# Altium project usb-cereal-cp.PrjPCB
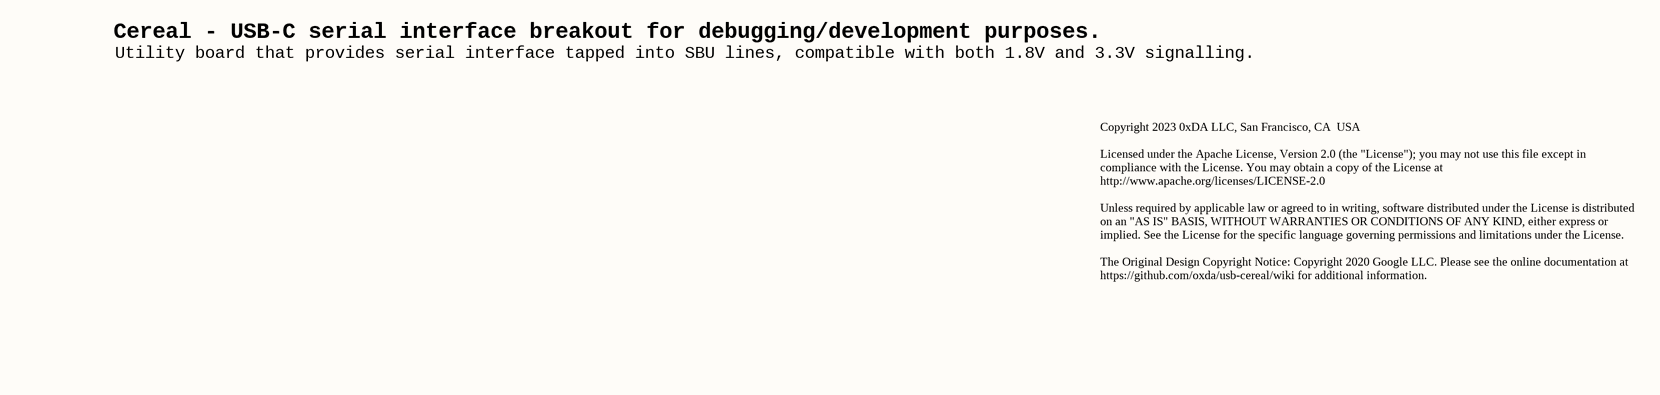
[diagram p0: usb-cereal-cp-sys.SchDoc]
2 sheets, 40 parts. Net scope: global (net labels, ports and power ports of the same name join across sheets).
Board file: usb-cereal-cp-pcb.PcbDoc
Sheets:
  usb-cereal-cp-sys.SchDoc
  usb-cereal-cp-sch.SchDoc

## Sheet usb-cereal-cp-sys.SchDoc: USB-Cereal Diagram
size Tabloid; Author: dnv; DocumentNumber: N/A; Revision: 1; SheetNumber: 1; SheetTotal: 2

### Notes on the sheet
- Cereal - USB-C serial interface breakout for debugging/development purposes.
- Utility board that provides serial interface tapped into SBU lines, compatible with both 1.8V and 3.3V signalling.
- Copyright 2023 0xDA LLC, San Francisco, CA  USA
  Licensed under the Apache License, Version 2.0 (the "License"); you may not use this file except in compliance with the License. You may obtain a copy of the License at  http://www.apache.org/licenses/LICENSE-2.0
  Unless required by applicable law or agreed to in writing, software distributed under the License is distributed on an "AS IS" BASIS, WITHOUT WARRANTIES OR CONDITIONS OF ANY KIND, either express or implied. See the License for the specific language governing permissions and limitations under the License.
  The Original Design Copyright Notice: Copyright 2020 Google LLC. Please see the online documentation at https://github.com/oxda/usb-cereal/wiki for additional information.
- GPN:
- Title:
- Revision:
- Size:
- Tabloid
- Author:
- Reviewers:
- Date:
- Time:
- Sheet
- of

## Sheet usb-cereal-cp-sch.SchDoc: USB-Cereal Schematics
size Tabloid; Author: dnv; DocumentNumber: N/A; Revision: 1; SheetNumber: 2; SheetTotal: 2
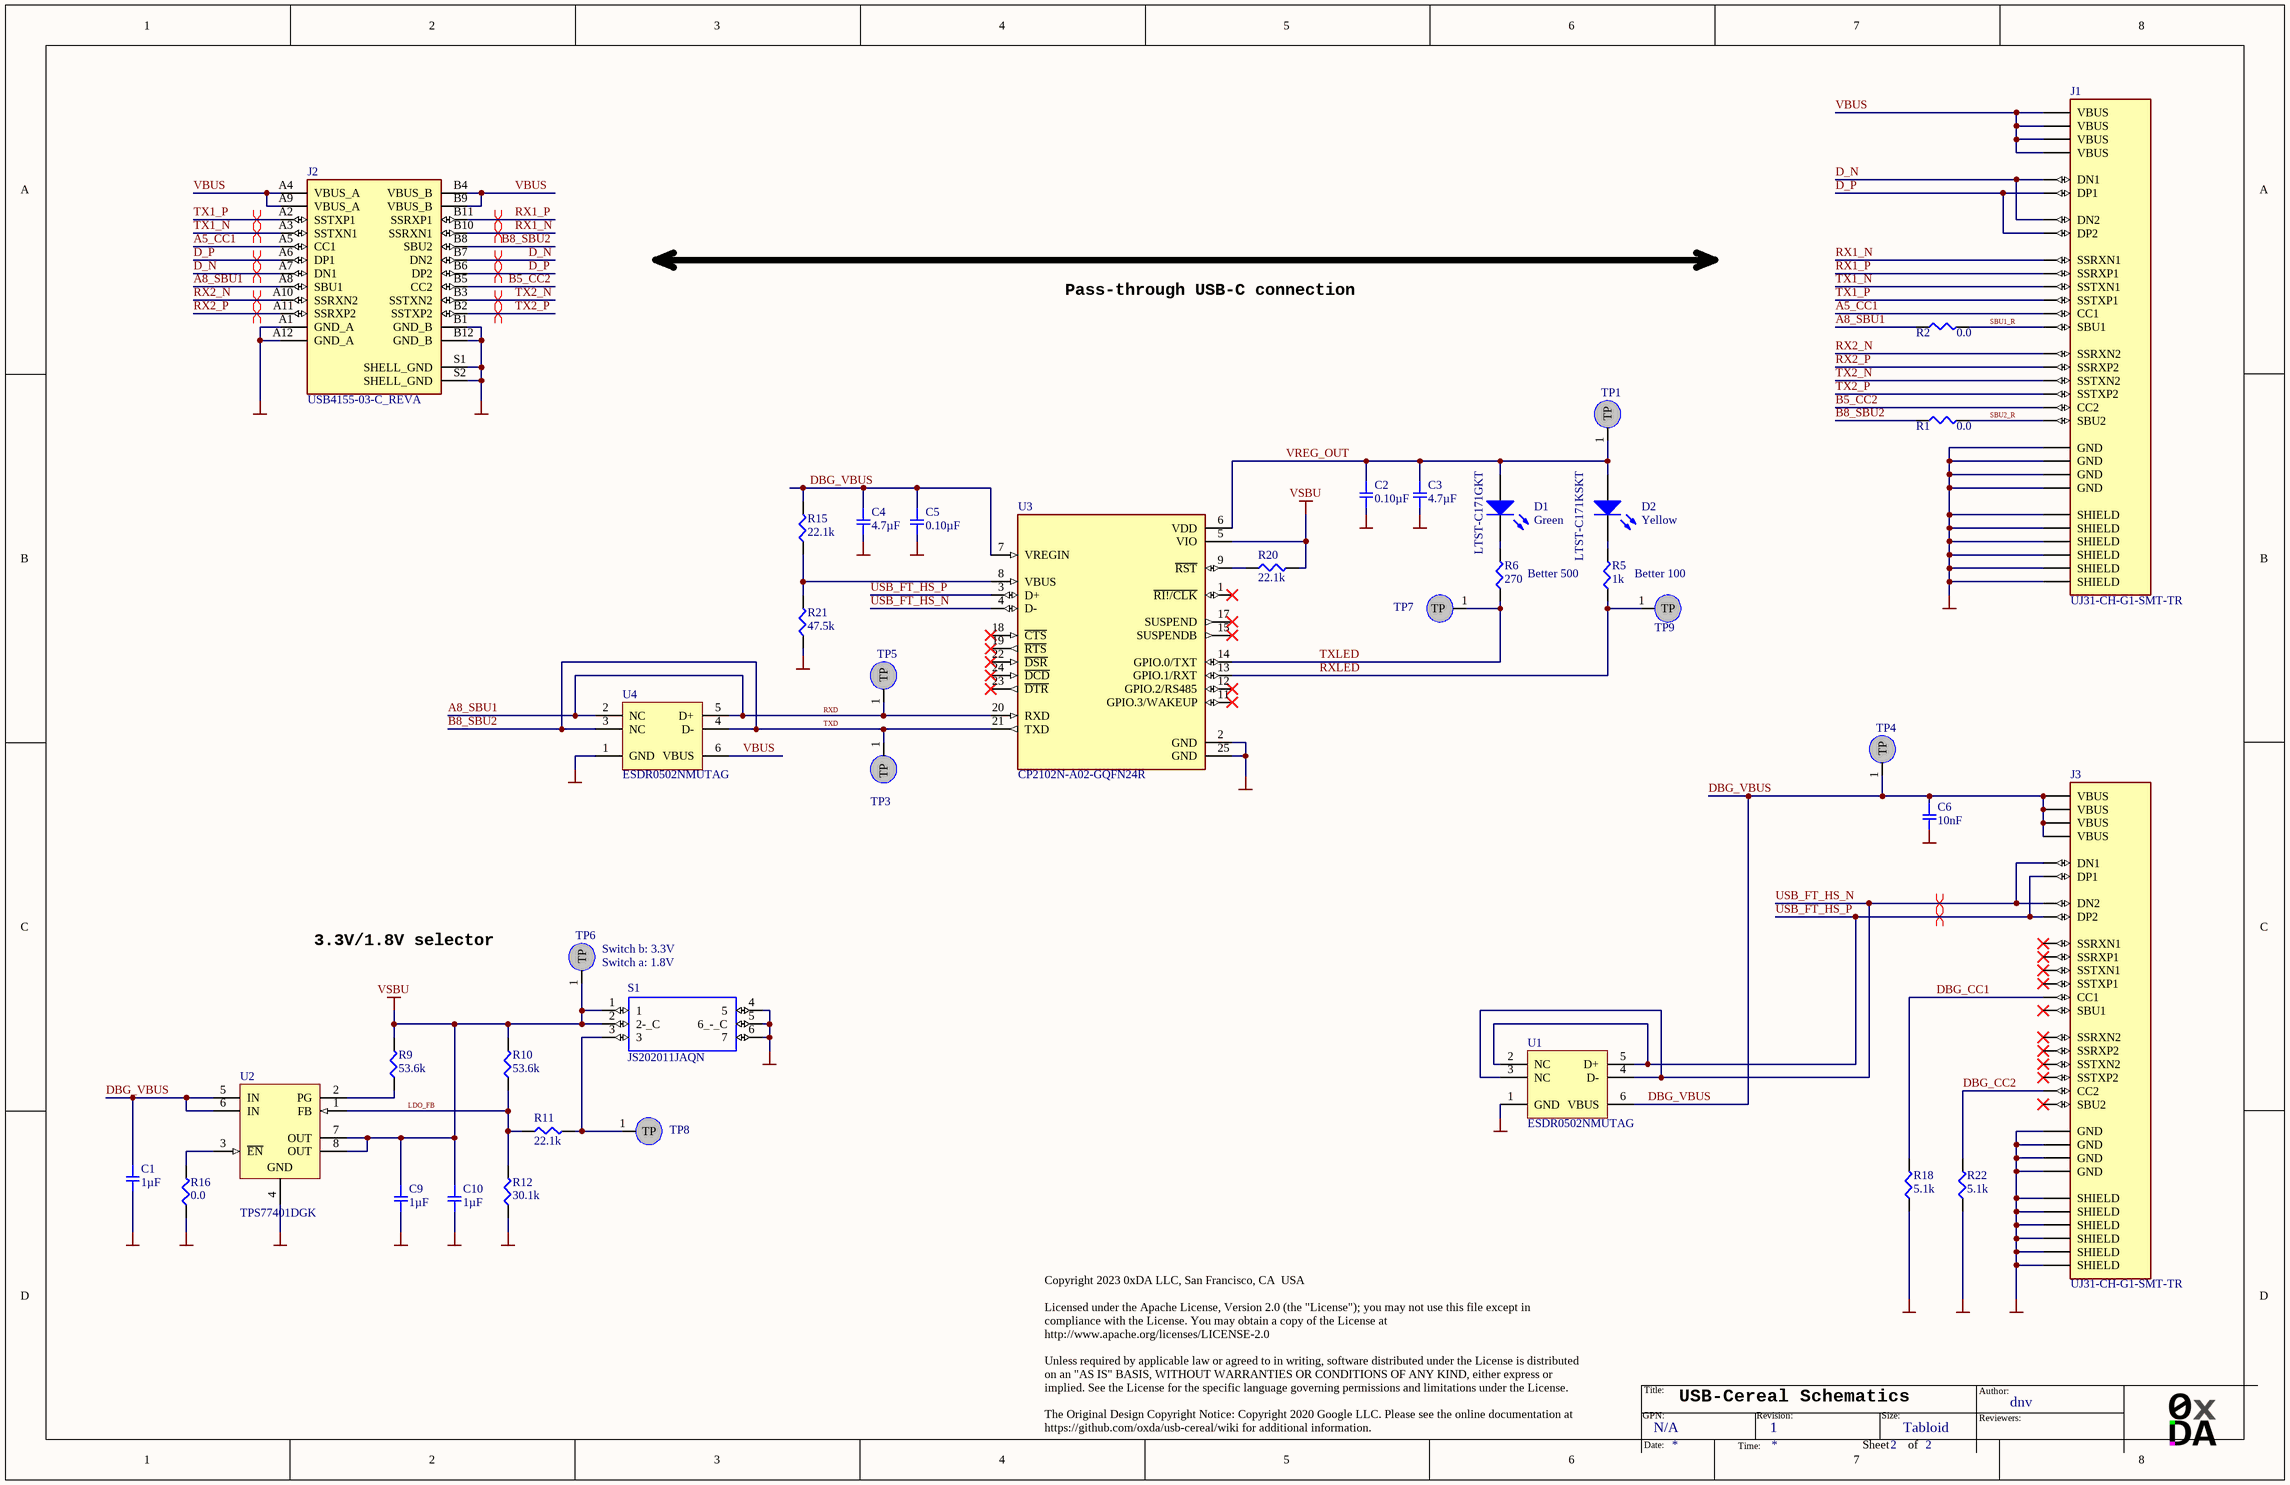
[diagram p1: usb-cereal-cp-sch.SchDoc]

### Parts
C1  1µF  [SMD-0402C]
C2  0.10µF  [SMD-0402C]
C3  4.7µF  [SMD-0402C]
C4  4.7µF  [SMD-0402C]
C5  0.10µF  [SMD-0402C]
C6  10nF  [SMD-0402C]
C9  1µF  [SMD-0402C]
C10  1µF  [SMD-0402C]
D1  LTST-C171GKT  Color: Green  [0805]
D2  LTST-C171KSKT  Color: Yellow  [0805]
J1  UJ31-CH-G1-SMT-TR  [CUI_UJ31-CH-G1-SMT-TR]
J2  USB4155-03-C_REVA  [GCT_USB4155-03-C_REVA]
J3  UJ31-CH-G1-SMT-TR  [CUI_UJ31-CH-G1-SMT-TR]
R1  0.0  [SMD-0402-RES]
R2  0.0  [SMD-0402-RES]
R5  1k  [SMD-0402-RES]
R6  270  [SMD-0402-RES]
R9  53.6k  [SMD-0402-RES]
R10  53.6k  [SMD-0402-RES]
R11  22.1k  [SMD-0402-RES]
R12  30.1k  [SMD-0402-RES]
R15  22.1k  [SMD-0402-RES]
R16  0.0  [SMD-0402-RES]
R18  5.1k  [SMD-0402-RES]
R20  22.1k  [SMD-0402-RES]
R21  47.5k  [SMD-0402-RES]
R22  5.1k  [SMD-0402-RES]
S1  JS202011JAQN  [JS202011JAQN]
TP1  GND  [Testpoint]  (value not drawn)  (net tie, no BOM)
TP3  GND  [Testpoint]  (value not drawn)  (net tie, no BOM)
TP4  GND  [Testpoint]  (value not drawn)  (net tie, no BOM)
TP5  GND  [Testpoint]  (value not drawn)  (net tie, no BOM)
TP6  GND  [Testpoint]  (value not drawn)  (net tie, no BOM)
TP7  GND  [Testpoint]  (value not drawn)  (net tie, no BOM)
TP8  GND  [Testpoint]  (value not drawn)  (net tie, no BOM)
TP9  GND  [Testpoint]  (value not drawn)  (net tie, no BOM)
U1  ESDR0502NMUTAG  [ONSC-UDFN-6-517AA-01_V]
U2  TPS77401DGK  [TI-DGK8_N]
U3  CP2102N-A02-GQFN24R  [QFN50P400X400X80-25N]
U4  ESDR0502NMUTAG  [ONSC-UDFN-6-517AA-01_V]

### Nets
GND: C1.2 C2.2 C3.2 C4.2 C5.2 C6.2 C9.2 C10.2 J1.A1(GND) J1.A12(GND) J1.B1(GND) J1.B12(GND) J1.SH1(SHIELD) J1.SH2(SHIELD) J1.SH3(SHIELD) J1.SH4(SHIELD) J1.SH5(SHIELD) J1.SH6(SHIELD) J2.A1(GND_A) J2.A12(GND_A) J2.B1(GND_B) J2.B12(GND_B) J2.S1(SHELL_GND) J2.S2(SHELL_GND) J3.A1(GND) J3.A12(GND) J3.B1(GND) J3.B12(GND) J3.SH1(SHIELD) J3.SH2(SHIELD) J3.SH3(SHIELD) J3.SH4(SHIELD) J3.SH5(SHIELD) J3.SH6(SHIELD) R12.1 R16.1 R18.1 R21.1 R22.1 S1.4(5) S1.5(6_-_C) S1.6(7) U1.1(GND) U2.4(GND) U3.2(GND) U3.25(GND) U4.1(GND)
VSBU: C9.1 C10.1 R9.2 R10.2 R20.2 S1.1 S1.2(2-_C) TP6.1(TP) U2.7(OUT) U2.8(OUT) U3.5(VIO)
A5_CC1: J1.A5(CC1) J2.A5(CC1)
A8_SBU1: J2.A8(SBU1) R2.1 TP5.1(TP) U3.20(RXD) U4.2(NC) U4.5(D+)  [also labelled RXD]
B5_CC2: J1.B5(CC2) J2.B5(CC2)
B8_SBU2: J2.B8(SBU2) R1.1 TP3.1(TP) U3.21(TXD) U4.3(NC) U4.4(D-)  [also labelled TXD]
D_N: J1.A7(DN1) J1.B7(DN2) J2.A7(DN1) J2.B7(DN2)
D_P: J1.A6(DP1) J1.B6(DP2) J2.A6(DP1) J2.B6(DP2)
DBG_CC1: J3.A5(CC1) R18.2
DBG_CC2: J3.B5(CC2) R22.2
DBG_VBUS: C1.1 C4.1 C5.1 C6.1 J3.A4(VBUS) J3.A9(VBUS) J3.B4(VBUS) J3.B9(VBUS) R15.2 TP4.1(TP) U1.6(VBUS) U2.5(IN) U2.6(IN) U3.7(VREGIN)
LDO_FB: R10.1 R11.1 R12.2 U2.1(FB)
RX1_N: J1.B10(SSRXN1) J2.B10(SSRXN1)
RX1_P: J1.B11(SSRXP1) J2.B11(SSRXP1)
RX2_N: J1.A10(SSRXN2) J2.A10(SSRXN2)
RX2_P: J1.A11(SSRXP2) J2.A11(SSRXP2)
RXLED: R5.1 TP9.1(TP) U3.13(GPIO.1/RXT)
SBU1_R: J1.A8(SBU1) R2.2
SBU2_R: J1.B8(SBU2) R1.2
TX1_N: J1.A3(SSTXN1) J2.A3(SSTXN1)
TX1_P: J1.A2(SSTXP1) J2.A2(SSTXP1)
TX2_N: J1.B3(SSTXN2) J2.B3(SSTXN2)
TX2_P: J1.B2(SSTXP2) J2.B2(SSTXP2)
TXLED: R6.1 TP7.1(TP) U3.14(GPIO.0/TXT)
USB_FT_HS_N: J3.A7(DN1) J3.B7(DN2) U1.3(NC) U1.4(D-) U3.4(D-)
USB_FT_HS_P: J3.A6(DP1) J3.B6(DP2) U1.2(NC) U1.5(D+) U3.3(D+)
VBUS: J1.A4(VBUS) J1.A9(VBUS) J1.B4(VBUS) J1.B9(VBUS) J2.A4(VBUS_A) J2.A9(VBUS_A) J2.B4(VBUS_B) J2.B9(VBUS_B) U4.6(VBUS)
VREG_OUT: C2.1 C3.1 D1.1(A) D2.1(A) TP1.1(TP) U3.6(VDD)
NetD1_2: D1.2(K) R6.2
NetD2_2: D2.2(K) R5.2
NetR9_1: R9.1 U2.2(PG)
NetR11_2: R11.2 S1.3 TP8.1(TP)
NetR15_1: R15.1 R21.2 U3.8(VBUS)
NetR16_2: R16.2 U2.3(~{EN})
NetR20_1: R20.1 U3.9(~{RST})

Not connected (* = marked no-connect by the designer): J3 A2(SSTXP1)* A3(SSTXN1)* A8(SBU1)* A10(SSRXN2)* A11(SSRXP2)* B2(SSTXP2)* B3(SSTXN2)* B8(SBU2)* B10(SSRXN1)* B11(SSRXP1)*; U3 1(~{RI!/CLK})* 11(GPIO.3/WAKEUP)* 12(GPIO.2/RS485)* 15(SUSPENDB)* 17(SUSPEND)* 18(~{CTS})* 19(~{RTS})* 22(~{DSR})* 23(~{DTR})* 24(~{DCD})*

### Layout directives
differential pair: D_N, D_P, RX1_N, RX1_P, RX2_N, RX2_P, TX1_N, TX1_P, TX2_N, TX2_P, USB_FT_HS_N, USB_FT_HS_P

### Notes on the sheet
- Pass-through USB-C connection
- Better 500
- Better 100
- 3.3V/1.8V selector
- (near TP6) Switch b: 3.3V
- (near TP6) Switch a: 1.8V
- Copyright 2023 0xDA LLC, San Francisco, CA  USA
  Licensed under the Apache License, Version 2.0 (the "License"); you may not use this file except in compliance with the License. You may obtain a copy of the License at  http://www.apache.org/licenses/LICENSE-2.0
  Unless required by applicable law or agreed to in writing, software distributed under the License is distributed on an "AS IS" BASIS, WITHOUT WARRANTIES OR CONDITIONS OF ANY KIND, either express or implied. See the License for the specific language governing permissions and limitations under the License.
  The Original Design Copyright Notice: Copyright 2020 Google LLC. Please see the online documentation at https://github.com/oxda/usb-cereal/wiki for additional information.
- GPN:
- Title:
- Revision:
- Size:
- Tabloid
- Author:
- Reviewers:
- Date:
- Time:
- Sheet
- of

### Library data of the parts
C1 C9 C10 = GCM155C71A105KE38D: CAP CER 1UF 10V X7S 0402; Manufacturer: Murata Electronics North America; Factory Stock: 0; Unit Price (USD): 0.12; Minimum Quantity: 1; Tolerance: ±10%; Datasheets: http://www.murata.com/~/media/webrenewal/support/library/catalog/products/capacitor/mlcc/c03e.ashx; Image: //media.digikey.com/Renders/Murata%20Renders/ZRB-SERIES-0402.jpg; Digi-Key Part Number: 490-13409-1-ND; Part Number: GCM155C71A105KE38D; Quantity Available: 7240; @ qty: 0; Packaging: Cut Tape (CT); Series: GCM; Part Status: Active; Value: 1µF; Voltage: 10V; Temperature Coefficient: X7S; Operating Temperature: -55°C ~ 125°C; Features: -; Ratings: AEC-Q200; Applications: Automotive; Mounting Type: Surface Mount, MLCC; Package / Case: 0402 (1005 Metric); Size / Dimension: 0.039" L x 0.020" W (1.00mm x 0.50mm); Height - Seated (Max): -; Thickness (Max): 0.022" (0.55mm); Lead Spacing: -; Lead Style: -
C2 C5 = GRM152R61A104KE19D: CAP CER 0.1UF 10V X5R 0402; Manufacturer: Murata Electronics North America; Factory Stock: 0; Unit Price (USD): 0.16; Minimum Quantity: 1; Tolerance: ±10%; Datasheets: http://www.murata.com/~/media/webrenewal/support/library/catalog/products/capacitor/mlcc/c02e.pdf; Image: //media.digikey.com/Renders/Murata%20Renders/ZRB-SERIES-0402.jpg; Digi-Key Part Number: 490-10008-1-ND; Part Number: GRM152R61A104KE19D; Quantity Available: 80241; @ qty: 0; Packaging: Cut Tape (CT); Series: GRM; Part Status: Active; Value: 0.10µF; Voltage: 10V; Temperature Coefficient: X5R; Operating Temperature: -55°C ~ 85°C; Features: Derating Recommended; Ratings: -; Applications: General Purpose; Mounting Type: Surface Mount, MLCC; Package / Case: 0402 (1005 Metric); Size / Dimension: 0.039" L x 0.020" W (1.00mm x 0.50mm); Height - Seated (Max): -; Thickness (Max): 0.009" (0.22mm); Lead Spacing: -; Lead Style: -
C3 C4 = ZRB15XR61A475KE01D: CAP CER 4.7UF 10V X5R 0402; Manufacturer: Murata Electronics North America; Factory Stock: 0; Unit Price (USD): 0.28; Minimum Quantity: 1; Tolerance: ±10%; Datasheets: http://search.murata.co.jp/Ceramy/image/img/A01X/G101/ENG/ZRB15XR61A475KE01-01.pdf; Image: //media.digikey.com/Renders/Murata%20Renders/ZRB-SERIES-0402.jpg; Digi-Key Part Number: 490-13252-1-ND; Part Number: ZRB15XR61A475KE01D; Quantity Available: 23076; @ qty: 0; Packaging: Cut Tape (CT); Series: ZRB; Part Status: Active; Value: 4.7µF; Voltage: 10V; Temperature Coefficient: X5R; Operating Temperature: -55°C ~ 85°C; Features: Derating Recommended, Interposer Termination; Ratings: -; Applications: Acoustic Noise Reduction; Mounting Type: Surface Mount, MLCC; Package / Case: 0402 (1005 Metric); Size / Dimension: 0.039" L x 0.020" W (1.00mm x 0.50mm); Height - Seated (Max): -; Thickness (Max): 0.031" (0.80mm); Lead Spacing: -; Lead Style: -
C6 = GCM155R71E103KA37D: CAP CER 10000PF 25V X7R 0402; Manufacturer: Murata Electronics North America; Factory Stock: 0; Unit Price (USD): 0.1; Minimum Quantity: 1; Tolerance: ±10%; Datasheets: http://www.murata.com/~/media/webrenewal/support/library/catalog/products/capacitor/mlcc/c03e.ashx; Image: //media.digikey.com/Renders/Murata%20Renders/ZRB-SERIES-0402.jpg; Digi-Key Part Number: 490-6043-1-ND; Part Number: GCM155R71E103KA37D; Quantity Available: 128782; @ qty: 0; Packaging: Cut Tape (CT); Series: GCM; Part Status: Active; Value: 10nF; Voltage: 25V; Temperature Coefficient: X7R; Operating Temperature: -55°C ~ 125°C; Features: -; Ratings: AEC-Q200; Applications: Automotive; Mounting Type: Surface Mount, MLCC; Package / Case: 0402 (1005 Metric); Size / Dimension: 0.039" L x 0.020" W (1.00mm x 0.50mm); Height - Seated (Max): -; Thickness (Max): 0.022" (0.55mm); Lead Spacing: -; Lead Style: -
D1 = LTST-C171GKT: LED
D2 = LTST-C171KSKT: LED
J1 J3 = UJ31-CH-G1-SMT-TR: Type C, USB 3.1 Gen 2, 5 A, Right Angle, Surface Mount _SMT_ , USB Receptacle; MF: CUI Devices; CUI_purchase_URL: https://www.cuidevices.com/product/interconnect/connectors/usb-connectors/uj31-ch-g1-smt-tr?utm_source=snapeda.com&utm_medium=referral&utm_campaign=snapedaBOM; Price: None; SnapEDA_Link: https://www.snapeda.com/parts/UJ31-CH-G1-SMT-TR/CUI%20Devices/view-part/2754415/?ref=snap; Package: None; Availability: Unavailable; Value: *; MP: UJ31-CH-G1-SMT-TR
J2 = USB4155-03-C_REVA: MF: Global Connector Technology; Package: None; Check_prices: https://www.snapeda.com/parts/USB4155-03-C/Global%20Connector%20Technology/view-part/5877141/?ref=eda; Value: *; Price: None; Availability: Unavailable; MP: USB4155-03-C; SnapEDA_Link: https://www.snapeda.com/parts/USB4155-03-C/Global%20Connector%20Technology/view-part/5877141/?ref=snap
R1 R2 R16 = ERJ-2GE0R00X: RES SMD 0.0OHM JUMPER 1/10W 0402; Manufacturer: Panasonic Electronic Components; Factory Stock: 0; Unit Price (USD): 0.00384; @ qty: 1500; Minimum Quantity: 1; Power (Watts): 0.1W, 1/10W; Part Number: ERJ-2GE0R00X; Datasheets: http://industrial.panasonic.com/www-cgi/jvcr13pz.cgi?E+PZ+3+AOA0001+ERJ2GE0R00X+7+WW; Image: //media.digikey.com/Photos/Panasonic%20Photos/ERJ-PA2-Series.jpg; Digi-Key Part Number: P0.0JCT-ND; Quantity Available: 3152483; Packaging: Cut Tape (CT); Series: ERJ; Part Status: Active; Value: 0.0; Tolerance: Jumper; Composition: Thick Film; Features: Automotive AEC-Q200; Temperature Coefficient: -; Operating Temperature: -55°C ~ 155°C; Package / Case: 0402 (1005 Metric); Supplier Device Package: 0402; Size / Dimension: 0.039" L x 0.020" W (1.00mm x 0.50mm); Height - Seated (Max): 0.016" (0.40mm); Number of Terminations: 2; Failure Rate: -
R5 = ERJ-PA2F1001X: RES SMD 1K OHM 1% 1/5W 0402; Manufacturer: Panasonic Electronic Components; Factory Stock: 0; Unit Price (USD): 0.03029; @ qty: 1500; Minimum Quantity: 1; Power (Watts): 0.2W, 1/5W; Temperature Coefficient: ±100ppm/°C; Part Number: ERJ-PA2F1001X; Datasheets: https://industrial.panasonic.com/cdbs/www-data/pdf/RDA0000/AOA0000C243.pdf; Image: //media.digikey.com/Photos/Panasonic%20Photos/ERJ-PA2-Series.jpg; Digi-Key Part Number: P17224CT-ND; Quantity Available: 20954; Packaging: Cut Tape (CT); Series: ERJ; Part Status: Active; Value: 1k; Tolerance: ±1%; Composition: Thick Film; Features: Automotive AEC-Q200, Pulse Withstanding; Operating Temperature: -55°C ~ 155°C; Package / Case: 0402 (1005 Metric); Supplier Device Package: 0402; Size / Dimension: 0.039" L x 0.020" W (1.00mm x 0.50mm); Height - Seated (Max): 0.016" (0.40mm); Number of Terminations: 2; Failure Rate: -
R6 = ERJ-2RKF2700X: RES SMD 270 OHM 1% 1/10W 0402; Manufacturer: Panasonic Electronic Components; Factory Stock: 0; Unit Price (USD): 0.00496; @ qty: 1500; Minimum Quantity: 1; Power (Watts): 0.1W, 1/10W; Temperature Coefficient: ±100ppm/°C; Part Number: ERJ-2RKF2700X; Datasheets: http://industrial.panasonic.com/www-cgi/jvcr13pz.cgi?E+PZ+3+AOA0002+ERJ2RKF2700X+7+WW; Image: //media.digikey.com/Photos/Panasonic%20Photos/ERJ-PA2-Series.jpg; Digi-Key Part Number: P270LCT-ND; Quantity Available: 74905; Packaging: Cut Tape (CT); Series: ERJ; Part Status: Active; Value: 270; Tolerance: ±1%; Composition: Thick Film; Features: Automotive AEC-Q200; Operating Temperature: -55°C ~ 155°C; Package / Case: 0402 (1005 Metric); Supplier Device Package: 0402; Size / Dimension: 0.039" L x 0.020" W (1.00mm x 0.50mm); Height - Seated (Max): 0.016" (0.40mm); Number of Terminations: 2; Failure Rate: -
R9 R10 = ERJ-2RKF5362X: RES SMD 53.6K OHM 1% 1/10W 0402; Manufacturer: Panasonic Electronic Components; Factory Stock: 0; Unit Price (USD): 0.00496; @ qty: 1500; Minimum Quantity: 1; Power (Watts): 0.1W, 1/10W; Temperature Coefficient: ±100ppm/°C; Part Number: ERJ-2RKF5362X; Datasheets: http://industrial.panasonic.com/www-cgi/jvcr13pz.cgi?E+PZ+3+AOA0002+ERJ2RKF5362X+7+WW; Image: //media.digikey.com/Photos/Panasonic%20Photos/ERJ-PA2-Series.jpg; Digi-Key Part Number: P53.6KLCT-ND; Quantity Available: 72822; Packaging: Cut Tape (CT); Series: ERJ; Part Status: Active; Value: 53.6k; Tolerance: ±1%; Composition: Thick Film; Features: Automotive AEC-Q200; Operating Temperature: -55°C ~ 155°C; Package / Case: 0402 (1005 Metric); Supplier Device Package: 0402; Size / Dimension: 0.039" L x 0.020" W (1.00mm x 0.50mm); Height - Seated (Max): 0.016" (0.40mm); Number of Terminations: 2; Failure Rate: -
R11 R15 R20 = ERJ-2RKF2212X: RES SMD 22.1K OHM 1% 1/10W 0402; Manufacturer: Panasonic Electronic Components; Factory Stock: 0; Unit Price (USD): 0.00496; @ qty: 1500; Minimum Quantity: 1; Power (Watts): 0.1W, 1/10W; Temperature Coefficient: ±100ppm/°C; Part Number: ERJ-2RKF2212X; Datasheets: http://industrial.panasonic.com/www-cgi/jvcr13pz.cgi?E+PZ+3+AOA0002+ERJ2RKF2212X+7+WW; Image: //media.digikey.com/Photos/Panasonic%20Photos/ERJ-PA2-Series.jpg; Digi-Key Part Number: P22.1KLCT-ND; Quantity Available: 155553; Packaging: Cut Tape (CT); Series: ERJ; Part Status: Active; Value: 22.1k; Tolerance: ±1%; Composition: Thick Film; Features: Automotive AEC-Q200; Operating Temperature: -55°C ~ 155°C; Package / Case: 0402 (1005 Metric); Supplier Device Package: 0402; Size / Dimension: 0.039" L x 0.020" W (1.00mm x 0.50mm); Height - Seated (Max): 0.016" (0.40mm); Number of Terminations: 2; Failure Rate: -
R12 = ERJ-2RKF3012X: RES SMD 30.1K OHM 1% 1/10W 0402; Manufacturer: Panasonic Electronic Components; Factory Stock: 0; Unit Price (USD): 0.00496; @ qty: 1500; Minimum Quantity: 1; Power (Watts): 0.1W, 1/10W; Temperature Coefficient: ±100ppm/°C; Part Number: ERJ-2RKF3012X; Datasheets: http://industrial.panasonic.com/www-cgi/jvcr13pz.cgi?E+PZ+3+AOA0002+ERJ2RKF3012X+7+WW; Image: //media.digikey.com/Photos/Panasonic%20Photos/ERJ-PA2-Series.jpg; Digi-Key Part Number: P30.1KLCT-ND; Quantity Available: 32482; Packaging: Cut Tape (CT); Series: ERJ; Part Status: Active; Value: 30.1k; Tolerance: ±1%; Composition: Thick Film; Features: Automotive AEC-Q200; Operating Temperature: -55°C ~ 155°C; Package / Case: 0402 (1005 Metric); Supplier Device Package: 0402; Size / Dimension: 0.039" L x 0.020" W (1.00mm x 0.50mm); Height - Seated (Max): 0.016" (0.40mm); Number of Terminations: 2; Failure Rate: -
R18 R22 = ERJ-2RKF5101X: RES SMD 5.1K OHM 1% 1/10W 0402; Manufacturer: Panasonic Electronic Components; Factory Stock: 0; Unit Price (USD): 0.00496; @ qty: 1500; Minimum Quantity: 1; Power (Watts): 0.1W, 1/10W; Temperature Coefficient: ±100ppm/°C; Part Number: ERJ-2RKF5101X; Datasheets: http://industrial.panasonic.com/www-cgi/jvcr13pz.cgi?E+PZ+3+AOA0002+ERJ2RKF5101X+7+WW; Image: //media.digikey.com/Photos/Panasonic%20Photos/ERJ-PA2-Series.jpg; Digi-Key Part Number: P5.10KLCT-ND; Quantity Available: 553973; Packaging: Cut Tape (CT); Series: ERJ; Part Status: Active; Value: 5.1k; Tolerance: ±1%; Composition: Thick Film; Features: Automotive AEC-Q200; Operating Temperature: -55°C ~ 155°C; Package / Case: 0402 (1005 Metric); Supplier Device Package: 0402; Size / Dimension: 0.039" L x 0.020" W (1.00mm x 0.50mm); Height - Seated (Max): 0.016" (0.40mm); Number of Terminations: 2; Failure Rate: -
R21 = ERJ-2RKF4752X: RES SMD 47.5K OHM 1% 1/10W 0402; Manufacturer: Panasonic Electronic Components; Factory Stock: 0; Unit Price (USD): 0.00496; @ qty: 1500; Minimum Quantity: 1; Power (Watts): 0.1W, 1/10W; Temperature Coefficient: ±100ppm/°C; Part Number: ERJ-2RKF4752X; Datasheets: http://industrial.panasonic.com/www-cgi/jvcr13pz.cgi?E+PZ+3+AOA0002+ERJ2RKF4752X+7+WW; Image: //media.digikey.com/Photos/Panasonic%20Photos/ERJ-PA2-Series.jpg; Digi-Key Part Number: P47.5KLCT-ND; Quantity Available: 168568; Packaging: Cut Tape (CT); Series: ERJ; Part Status: Active; Value: 47.5k; Tolerance: ±1%; Composition: Thick Film; Features: Automotive AEC-Q200; Operating Temperature: -55°C ~ 155°C; Package / Case: 0402 (1005 Metric); Supplier Device Package: 0402; Size / Dimension: 0.039" L x 0.020" W (1.00mm x 0.50mm); Height - Seated (Max): 0.016" (0.40mm); Number of Terminations: 2; Failure Rate: -
S1 = JS202011JAQN: Slide Switch DPDT Surface Mount, Right Angle; MF: C&K; SnapEDA_Link: https://www.snapeda.com/parts/JS202011JAQN/C&K/view-part/564121/?ref=snap; Availability: Unavailable; Package: None; Price: None; MP: JS202011JAQN; Value: *
TP1 TP3-TP9 = Testpoint
U1 U4 = ESDR0502NMUTAG: Ultra Low Capacitance ESD Protection Array for High Speed Data Line Protection, 6-Pin UDFN, Pb-Free, Tape and Reel; Manufacturer: On Semiconductor; C Max (pF): 0.6; Direction: Unidirectional; IR Max (uA): 1; Number of Lines: 4; PPK Max (W): 100; V(BR) Min (V): 6; VRWM Max (V): 5.5; DatasheetVersion: Rev. 4; PackageVersion: Rev. D, 09/2010; PackageReference: UDFN-6-517AA-01; PackageDescription: 6-Pin Small Outline No-Lead, Body 1.2 x 1 mm, Pitch 0.4 mm; Supplier 1: Newark; Supplier Part Number 1: 92T2061; Supplier 2: Mouser; Supplier Part Number 2: 863-ESDR0502NMUTAG; Packing: Tape and Reel; RoHS: Pb-Free; Mounting Technology: Surface Mount; PartNumber: ESDR0502NMUTAG; ComponentLink1Description: Manufacturer URL; ComponentLink1URL: http://www.onsemi.com/; ComponentLink2Description: Datasheet; ComponentLink2URL: http://www.onsemi.cn/pub_link/Collateral/ESDR0502N-D.PDF; ComponentLink3Description: Package Specification; ComponentLink3URL: http://www.onsemi.com/pub_link/Collateral/517AA.PDF
U2 = TPS77401DGK: Single Output Fast Transient Response LDO, 250 mA, Adjustable 1.5 to 5.5 V Output, 2.7 to 10 V Input, with Power Good Output, 8-pin MSOP (DGK), -40 to 125 degC, Green (RoHS & no Sb/Br); Manufacturer: Texas Instruments; Accuracy(%): 2; Iout(Max)(A): 0.25; Iq(Typ)(mA): 0.09; Power Good: TRUE; SubFamily: Single Channel LDO; Vdo(Typ)(mV): 200; Vin(Max)(V): 10; Vin(Min)(V): 2.7; Vout Adj(Max)(V): 5.5; Vout Adj(Min)(V): 1.5; DatasheetVersion: SLVS281E; PackageVersion: 4073329/E; PackageReference: DGK8; PackageDescription: 8-Pin Thin Small Outline Package 3 x 3 mm Body ,0.65 mm Pitch; Supplier 1: Digi-Key; Supplier Part Number 1: 296-8115-5-ND; Supplier 2: Newark; Supplier Part Number 2: 77C1228; Supplier 3: Mouser; Supplier Part Number 3: 595-TPS77401DGK; Eco-Plan: Green (RoHS & no Sb/Br); Mounting Technology: Surface Mount; Code_JEDEC: MO-187; PartNumber: TPS77401DGK; ComponentLink1Description: Manufacturer URL; ComponentLink1URL: http://www.ti.com/; ComponentLink2Description: Datasheet; ComponentLink2URL: http://www.ti.com/general/docs/lit/getliterature.tsp?genericPartNumber=TPS77401&fileType=pdf; ComponentLink3Description: Package Specification; ComponentLink3URL: http://www.ti.com/litv/pdf/mpds028d
U3 = CP2102N-A02-GQFN24R: USB Bridge, USB to UART USB 2.0 UART Interface 24-QFN _4x4_; MF: Silicon Labs; Package: WFQFN-24 Silicon Labs; Price: None; Availability: Unavailable; MP: CP2102N-A02-GQFN24R; SnapEDA_Link: https://www.snapeda.com/parts/CP2102N-A02-GQFN24R/Silicon%20Labs/view-part/3601234/?ref=snap; Value: *

## Assembly variants
Populated: not fitted R13 R14